# Altium schematic sheet bqZUM_Autoreset.SchDoc: Auto reset
size A4; Author: bq; CompanyName: bq - Mundo Reader; Organization: bq - Mundo Reader; DocumentNumber: 3; Revision: 0; SheetNumber: 3; SheetTotal: 8; ProjectName: bqduino
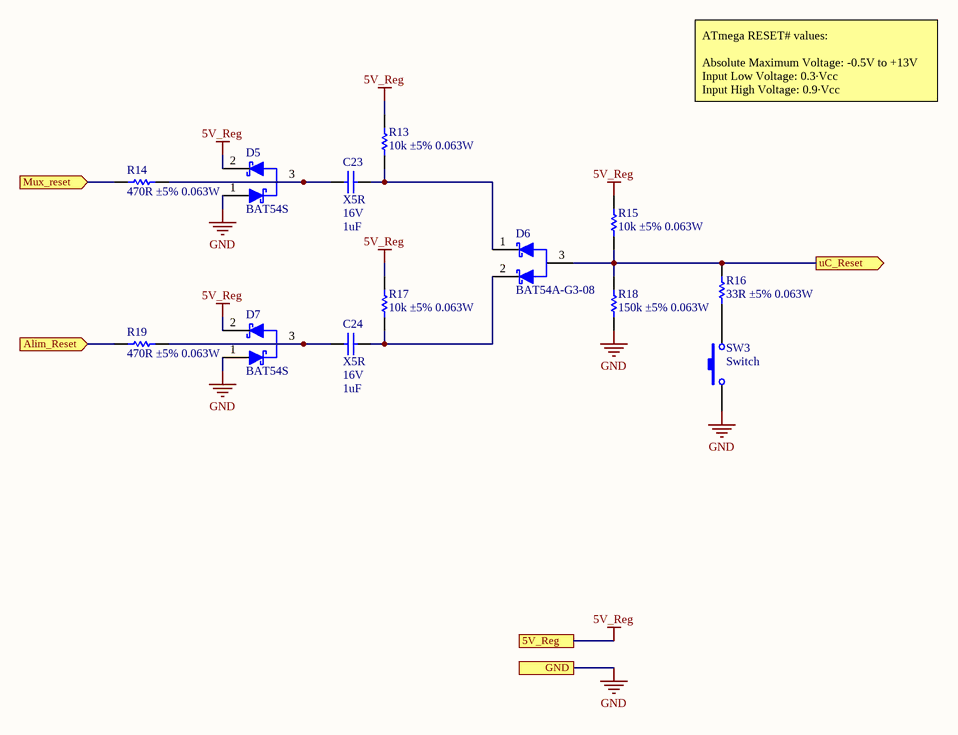
[diagram p0: bqZUM_Autoreset.SchDoc]

## Parts
C23  Dielectric: X5R  Voltage: 16V  Capacitance: 1uF  [C0603]  (hidden comment: Capacitor)
C24  Dielectric: X5R  Voltage: 16V  Capacitance: 1uF  [C0603]  (hidden comment: Capacitor)
D5  BAT54S  [SOT23-3]
D6  BAT54A-G3-08  [SOT23-3]
D7  BAT54S  [SOT23-3]
R13  value 10k ±5% 0.063W  [R0402]  (hidden comment: Resistor)
R14  value 470R ±5% 0.063W  [R0402]  (hidden comment: Resistor)
R15  value 10k ±5% 0.063W  [R0402]  (hidden comment: Resistor)
R16  value 33R ±5% 0.063W  [R0402]  (hidden comment: Resistor)
R17  value 10k ±5% 0.063W  [R0402]  (hidden comment: Resistor)
R18  value 150k ±5% 0.063W  [R0402]  (hidden comment: Resistor)
R19  value 470R ±5% 0.063W  [R0402]  (hidden comment: Resistor)
SW3  Switch  [SW_Vert_THT_7.5x6x6.5]

## Ports
5V_Reg, Alim_Reset (in), GND, Mux_reset (in), uC_Reset (out)

## Nets
5V_Reg: D5.2(K2) D7.2(K2) R13.2 R15.2 R17.2 ; port 5V_Reg
GND: D5.1(A) D7.1(A) R18.1 SW3.2 ; port GND
Alim_Reset: R19.1 ; port Alim_Reset
Mux_reset: R14.1 ; port Mux_reset
uC_Reset: D6.3(K) R15.1 R16.2 R18.2 ; port uC_Reset
NetC23_1: C23.1 D5.3(K1) R14.2
NetC23_2: C23.2 D6.1(A1) R13.1
NetC24_1: C24.1 D7.3(K1) R19.2
NetC24_2: C24.2 D6.2(A2) R17.1
NetR16_1: R16.1 SW3.1

## Notes on the sheet
- ATmega RESET# values:
  Absolute Maximum Voltage: -0.5V to +13V
  Input Low Voltage: 0.3·Vcc
  Input High Voltage: 0.9·Vcc
- Title
- Project
- Size:
- Author
- A4
- Number:
- Revision:
- Date:
- Time:
- Sheet
- of

## Library data of the parts
C23 C24 = C0603_1uF_16V_±10%: Manufacturer: Kemet; Value: 1uF ±10% 16V; Tolerance: ±10%; OrderingCode: C0603C105K4PAC
D5 = BAT54S: Dual Schottky Diode; Manufacturer: NXP; OrderingCode: BAT54S
D6 = BAT54A: Dual Schottky Diode Common Anode; Manufacturer: Vishay; OrderingCode: BAT54A-G3-08
D7 = BAT54S: Dual Schottky Diode; Manufacturer: NXP; Ifor: 200mA; Vrrm: 30V; Ifsm: 600mA; Vf: 0,8V; Value: 200mA 30V; OrderingCode: BAT54S; Manufacturer 2: Vishay; OrderingCode 2: BAT54S
R13 R15 R17 = R0402_10k_0.063W_±5%: Manufacturer: Vishay; Tolerance: ±5%; OrderingCode: CRCW040210K0JN; Power: 0.063W; Resistance: 10k; PackageDescription: SMD
R14 R19 = R0402_470R_0.063W_±5%: Manufacturer: Vishay; Tolerance: ±5%; OrderingCode: CRCW0402470RJN; Power: 0.063W; Resistance: 470R; PackageDescription: SMD
R16 = R0402_33R_0.063W_±5%: Manufacturer: Vishay; Tolerance: ±5%; OrderingCode: CRCW040233R0JN; Power: 0.063W; Resistance: 33R; PackageDescription: SMD
R18 = R0402_150k_0.063W_±5%: Manufacturer: Vishay; Tolerance: ±5%; OrderingCode: CRCW0402150KJN; Power: 0.063W; Resistance: 150k; PackageDescription: SMD
SW3 = SW Vertical THT: Micro miniature pushbutton surface Switch; Manufacturer: C&K Components; OrderingCode: PTS645VL39-2 LFS